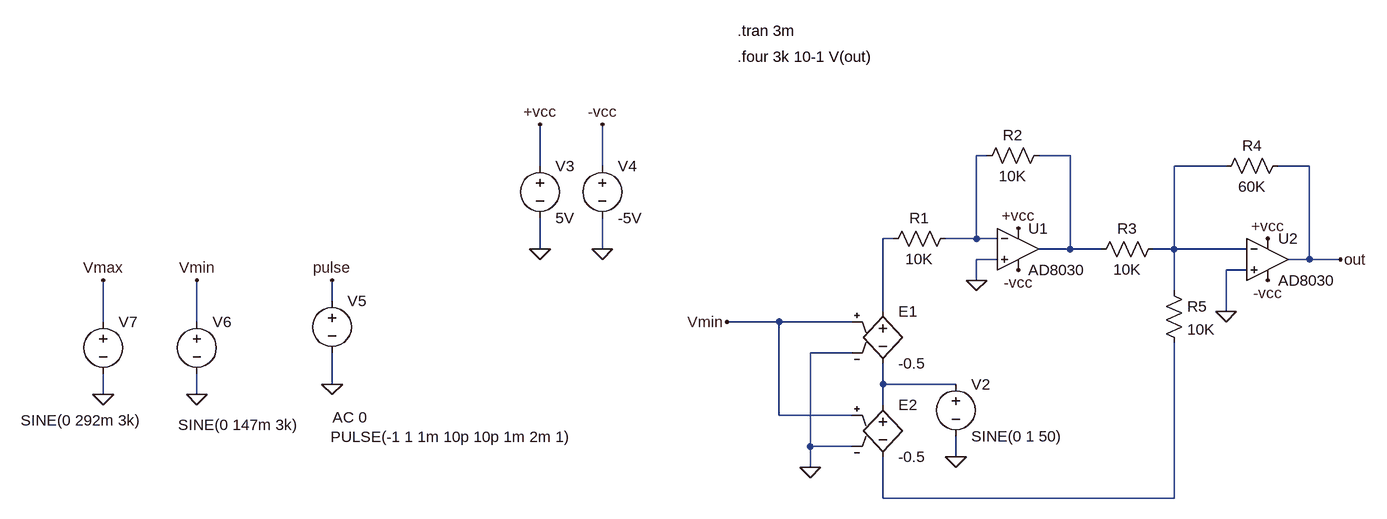
[diagram p0: schematic AOInstrumentatie_trans_SR_THD.asc]
AOInstrumentatie_trans_SR_THD.asc, the LTspice schematic file:
Version 4.1
SHEET 1 880 680
WIRE 16 32 0 32
WIRE 144 32 96 32
WIRE -672 48 -672 -16
WIRE -576 48 -576 -16
WIRE 384 48 304 48
WIRE 512 48 464 48
WIRE -128 160 -144 160
WIRE 0 160 0 32
WIRE 0 160 -48 160
WIRE 32 160 0 160
WIRE -672 176 -672 128
WIRE -576 176 -576 128
WIRE 144 176 144 32
WIRE 144 176 96 176
WIRE 192 176 144 176
WIRE 304 176 304 48
WIRE 304 176 272 176
WIRE 416 176 304 176
WIRE 32 192 0 192
WIRE 512 192 512 48
WIRE 512 192 480 192
WIRE 560 192 512 192
WIRE 416 208 384 208
WIRE 0 224 0 192
WIRE 304 240 304 176
WIRE -992 256 -992 224
WIRE -144 272 -144 160
WIRE 384 272 384 208
WIRE -1344 288 -1344 224
WIRE -1200 288 -1200 224
WIRE -304 288 -384 288
WIRE -192 288 -304 288
WIRE -192 336 -256 336
WIRE -992 384 -992 336
WIRE -144 384 -144 352
WIRE -32 384 -144 384
WIRE -1344 400 -1344 368
WIRE -1200 400 -1200 368
WIRE -144 416 -144 384
WIRE -304 432 -304 288
WIRE -192 432 -304 432
WIRE -256 480 -256 336
WIRE -192 480 -256 480
WIRE -32 496 -32 464
WIRE -256 512 -256 480
WIRE -144 560 -144 496
WIRE 304 560 304 320
WIRE 304 560 -144 560
FLAG -32 496 0
FLAG -256 512 0
FLAG 384 272 0
FLAG 0 224 0
FLAG -576 176 0
FLAG -672 176 0
FLAG -672 -16 +vcc
FLAG -576 -16 -vcc
FLAG 64 144 +vcc
FLAG 448 160 +vcc
FLAG 64 208 -vcc
FLAG 448 224 -vcc
FLAG 560 192 out
FLAG -992 384 0
FLAG -1200 400 0
FLAG -1344 400 0
FLAG -992 224 pulse
FLAG -1200 224 Vmin
FLAG -1344 224 Vmax
FLAG -384 288 Vmin
SYMBOL OpAmps\\AD8030 64 112 R0
SYMATTR InstName U1
SYMBOL OpAmps\\AD8030 448 128 R0
SYMATTR InstName U2
SYMBOL res -32 144 R90
WINDOW 0 0 56 VBottom 2
WINDOW 3 32 56 VTop 2
SYMATTR InstName R1
SYMATTR Value 10K
SYMBOL res 112 16 R90
WINDOW 0 0 56 VBottom 2
WINDOW 3 32 56 VTop 2
SYMATTR InstName R2
SYMATTR Value 10K
SYMBOL res 288 160 R90
WINDOW 0 0 56 VBottom 2
WINDOW 3 32 56 VTop 2
SYMATTR InstName R3
SYMATTR Value 10K
SYMBOL res 368 64 R270
WINDOW 0 32 56 VTop 2
WINDOW 3 0 56 VBottom 2
SYMATTR InstName R4
SYMATTR Value 60K
SYMBOL res 288 224 R0
SYMATTR InstName R5
SYMATTR Value 10K
SYMBOL e -144 256 R0
SYMATTR InstName E1
SYMATTR Value -0.5
SYMBOL e -144 400 R0
SYMATTR InstName E2
SYMATTR Value -0.5
SYMBOL voltage -32 368 R0
WINDOW 123 0 0 Left 0
WINDOW 39 0 0 Left 0
SYMATTR InstName V2
SYMATTR Value SINE(0 1 50)
SYMBOL voltage -672 32 R0
WINDOW 123 0 0 Left 0
WINDOW 39 0 0 Left 0
SYMATTR InstName V3
SYMATTR Value 5V
SYMBOL voltage -576 32 R0
WINDOW 123 0 0 Left 0
WINDOW 39 0 0 Left 0
SYMATTR InstName V4
SYMATTR Value -5V
SYMBOL voltage -992 240 R0
WINDOW 3 -2 225 Left 2
WINDOW 123 1 195 Left 2
WINDOW 39 0 0 Left 0
SYMATTR Value PULSE(-1 1 1m 10p 10p 1m 2m 1)
SYMATTR Value2 AC 0
SYMATTR InstName V5
SYMBOL voltage -1200 272 R0
WINDOW 3 -29 175 Left 2
WINDOW 123 0 0 Left 0
WINDOW 39 0 0 Left 0
SYMATTR Value SINE(0 147m 3k)
SYMATTR InstName V6
SYMBOL voltage -1344 272 R0
WINDOW 3 -127 168 Left 2
WINDOW 123 0 0 Left 0
WINDOW 39 0 0 Left 0
SYMATTR Value SINE(0 292m 3k)
SYMATTR InstName V7
TEXT -368 -160 Left 2 !.tran 3m
TEXT -368 -120 Left 2 !.four 3k 10-1 V(out)

The netlist it stands for:
* AOInstrumentatie_trans_SR_THD.asc
X§U1 0 N001 +vcc -vcc N002 AD8040  ; AD8030, pins In+ In- V+ V- OUT
X§U2 0 N003 +vcc -vcc out AD8040  ; AD8030, pins In+ In- V+ V- OUT
R1 N001 N004 10K
R2 N002 N001 10K
R3 N003 N002 10K
R4 N003 out 60K
R5 N003 N006 10K
E1 N004 N005 Vmin 0 -0.5
E2 N005 N006 Vmin 0 -0.5
V2 N005 0 SINE(0 1 50)
V3 +vcc 0 5V
V4 -vcc 0 -5V
V5 pulse 0 PULSE(-1 1 1m 10p 10p 1m 2m 1) AC 0
V6 Vmin 0 SINE(0 147m 3k)
V7 Vmax 0 SINE(0 292m 3k)
.tran 3m
.four 3k 10-1 V(out)
.lib ADI.lib
.backanno
.end